# EAGLE design eTapper1main36 (EAGLE 8.4.0)
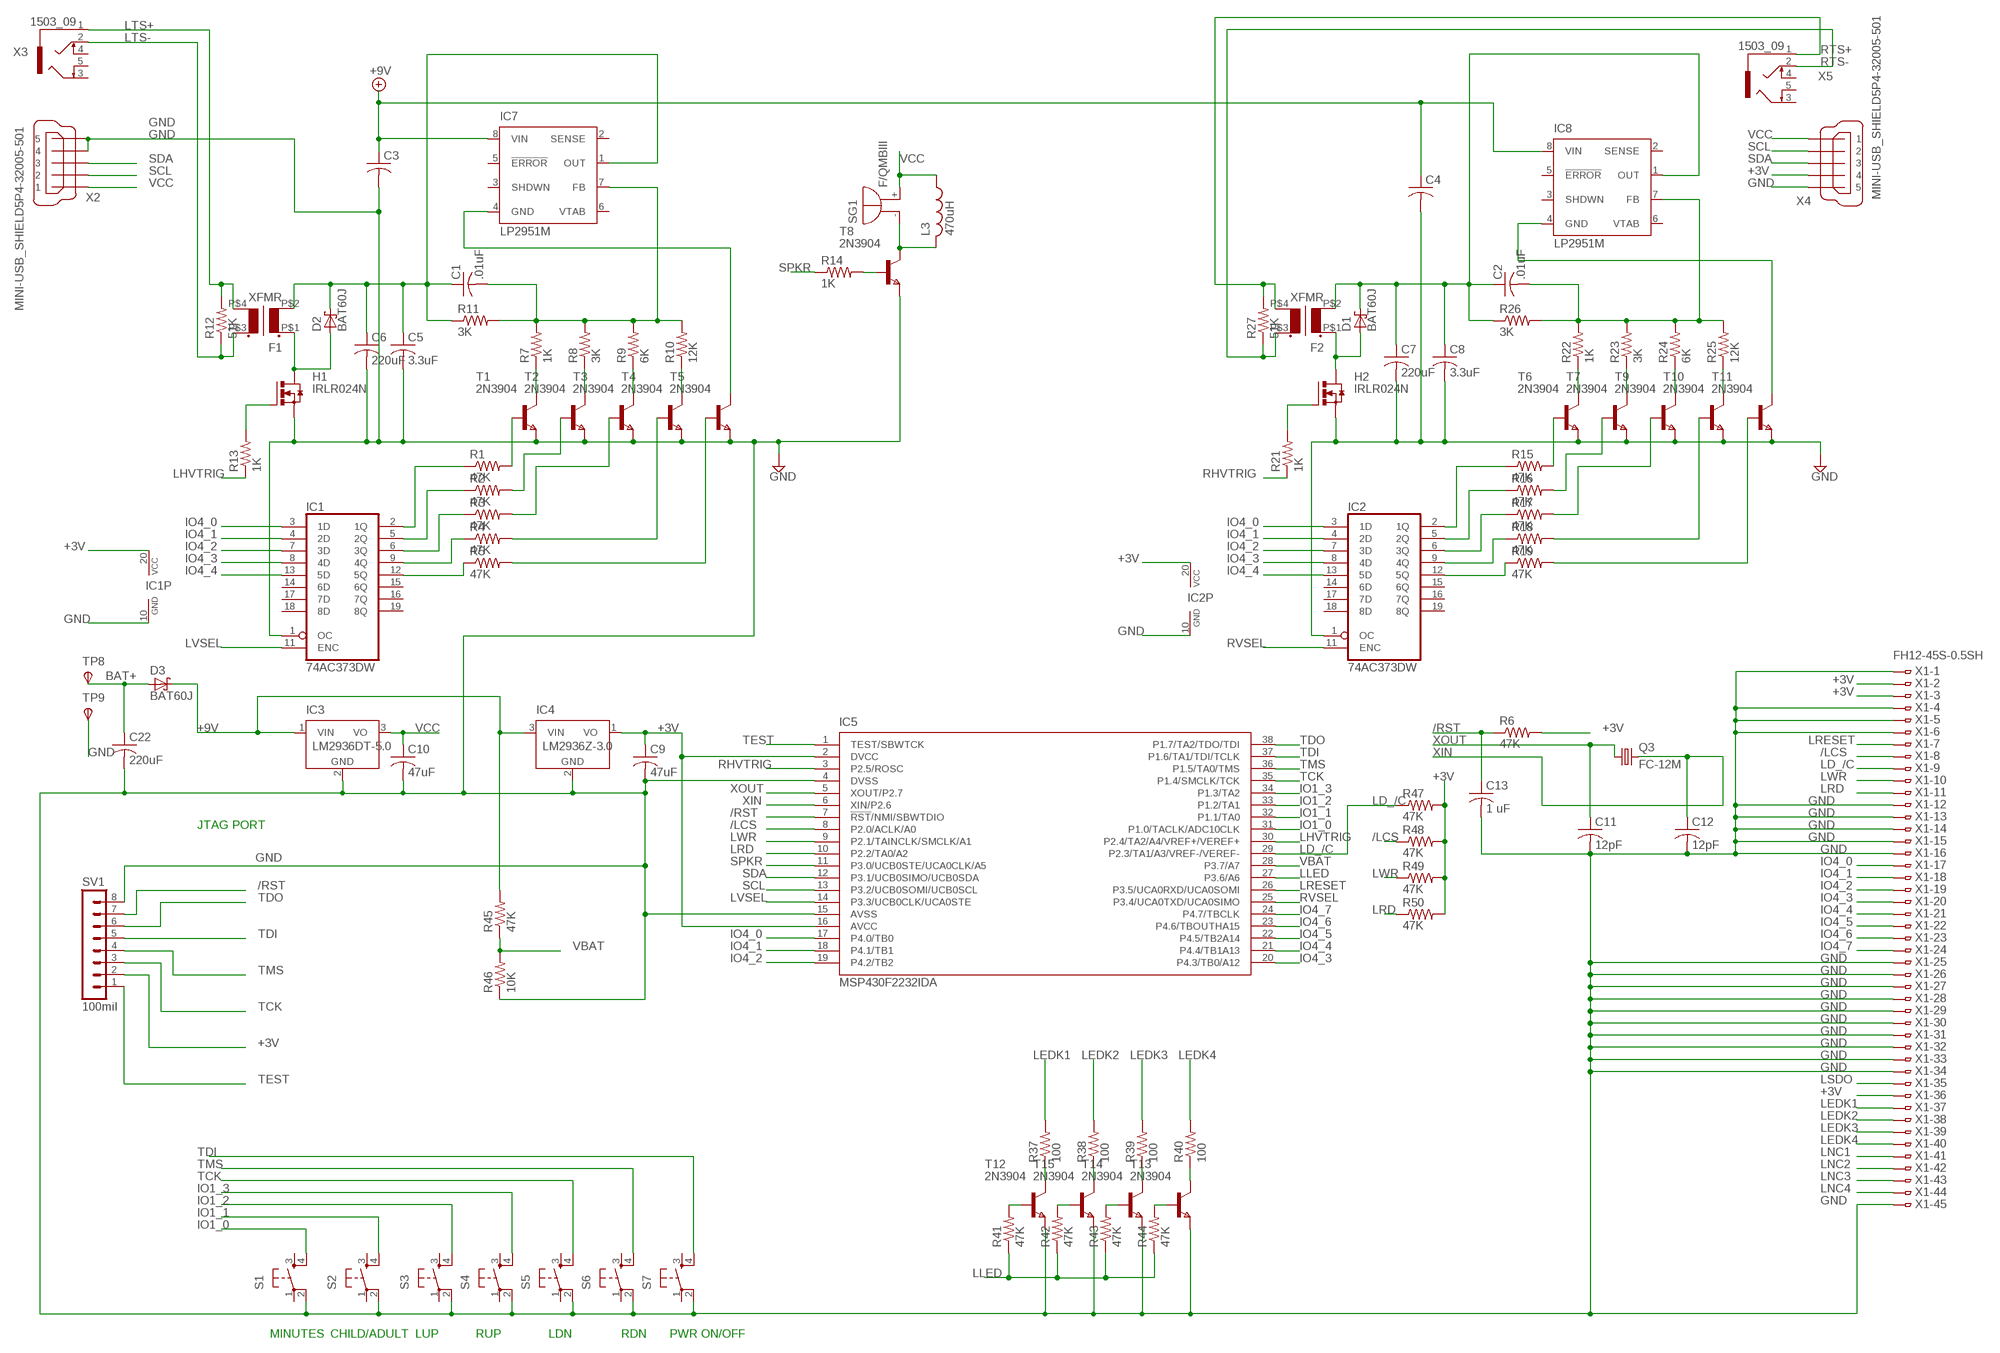
[diagram p0: schematic, sheet 1]

## Parts
C1  .01uF  C-USC0805  [C0805]
C2  .01uF  C-USC0805  [C0805]
C3  C-USC0805  [C0805]
C4  C-USC0805  [C0805]
C5  3.3uF  C-USC0805  [C0805]
C6  220uF  C-USC0805  [C0805]
C7  220uF  C-USC0805  [C0805]
C8  3.3uF  C-USC0805  [C0805]
C9  47uF  C-USC0805  [C0805]
C10  47uF  C-USC0805  [C0805]
C11  12pF  C-USC0805  [C0805]
C12  12pF  C-USC0805  [C0805]
C13  1 uF  C-USC0805  [C0805]
C22  220uF  C-USC0805  [C0805]
D1  BAT60J  [SOD323_ST]
D2  BAT60J  [SOD323_ST]
D3  BAT60J  [SOD323_ST]
F1  XFMR  [XFMR]
F2  XFMR  [XFMR]
H1  IRLR024N  [D-PAK_TO252AA]
H2  IRLR024N  [D-PAK_TO252AA]
IC1  74AC373DW  [SO20W]
IC2  74AC373DW  [SO20W]
IC3  LM2936DT-5.0  [TO252]
IC4  LM2936Z-3.0  [TO92]
IC5  MSP430F2232IDA  [TSSOP38_R-PDSO-G38-DA]
IC7  LP2951M  [SO08]
IC8  LP2951M  [SO08]
L3  470uH  L-USL2825P  [L2825P]
Q3  FC-12M  [FC-12M]
R1  47K  R-US_R0402  [R0402]
R2  47K  R-US_R0402  [R0402]
R3  47K  R-US_R0402  [R0402]
R4  47K  R-US_R0402  [R0402]
R5  47K  R-US_R0402  [R0402]
R6  47K  R-US_R0402  [R0402]
R7  1K  R-US_R0402  [R0402]
R8  3K  R-US_R0402  [R0402]
R9  6K  R-US_R0402  [R0402]
R10  12K  R-US_R0402  [R0402]
R11  3K  R-US_R0402  [R0402]
R12  51K  R-US_R0402  [R0402]
R13  1K  R-US_R0402  [R0402]
R14  1K  R-US_R0402  [R0402]
R15  47K  R-US_R0402  [R0402]
R16  47K  R-US_R0402  [R0402]
R17  47K  R-US_R0402  [R0402]
R18  47K  R-US_R0402  [R0402]
R19  47K  R-US_R0402  [R0402]
R21  1K  R-US_R0402  [R0402]
R22  1K  R-US_R0402  [R0402]
R23  3K  R-US_R0402  [R0402]
R24  6K  R-US_R0402  [R0402]
R25  12K  R-US_R0402  [R0402]
R26  3K  R-US_R0402  [R0402]
R27  51K  R-US_R0402  [R0402]
R37  100  R-US_R0402  [R0402]
R38  100  R-US_R0402  [R0402]
R39  100  R-US_R0402  [R0402]
R40  100  R-US_R0402  [R0402]
R41  47K  R-US_R0402  [R0402]
R42  47K  R-US_R0402  [R0402]
R43  47K  R-US_R0402  [R0402]
R44  47K  R-US_R0402  [R0402]
R45  47K  R-US_R0402  [R0402]
R46  10K  R-US_R0402  [R0402]
R47  47K  R-US_R0402  [R0402]
R48  47K  R-US_R0402  [R0402]
R49  47K  R-US_R0402  [R0402]
R50  47K  R-US_R0402  [R0402]
S1  10-XX  [B3F-10XX]
S2  10-XX  [B3F-10XX]
S3  10-XX  [B3F-10XX]
S4  10-XX  [B3F-10XX]
S5  10-XX  [B3F-10XX]
S6  10-XX  [B3F-10XX]
S7  10-XX  [B3F-10XX]
SG1  F/QMBIII  [F/QMBIII]
SV1  100mil  MA08-1  [MA08-1]
T1  2N3904  NPNSOT23  [SOT-23]
T2  2N3904  NPNSOT23  [SOT-23]
T3  2N3904  NPNSOT23  [SOT-23]
T4  2N3904  NPNSOT23  [SOT-23]
T5  2N3904  NPNSOT23  [SOT-23]
T6  2N3904  NPNSOT23  [SOT-23]
T7  2N3904  NPNSOT23  [SOT-23]
T8  2N3904  NPNSOT23  [SOT-23]
T9  2N3904  NPNSOT23  [SOT-23]
T10  2N3904  NPNSOT23  [SOT-23]
T11  2N3904  NPNSOT23  [SOT-23]
T12  2N3904  NPNSOT23  [SOT-23]
T13  2N3904  NPNSOT23  [SOT-23]
T14  2N3904  NPNSOT23  [SOT-23]
T15  2N3904  NPNSOT23  [SOT-23]
TP8  TPSTP06R  [TP06R]
TP9  TPSTP06R  [TP06R]
X1  FH12-45S-0.5SH  [FH12-45S-0.5SH]
X2  MINI-USB_SHIELD5P4-32005-501  [32005-501]
X3  1503_09  [1503_09]
X4  MINI-USB_SHIELD5P4-32005-501  [32005-501]
X5  1503_09  [1503_09]

## Nets
+3V [+3V]: C9.1 IC1.20(VCC) IC2.20(VCC) IC4.1(VO) IC5.2(DVCC) IC5.16(AVCC) R6.2 R47.2 R48.2 R49.2 R50.2 SV1.2 X1.2 X1.3 X1.36 X4.4
+9V [+9V]: C3.1 C4.1 D3.C IC3.1(VIN) IC4.3(VIN) IC7.8(VIN) IC8.8(VIN) R45.2
/LCS: IC5.8(P2.0/ACLK/A0) R48.1 X1.8
/RST: C13.1 IC5.7(!RST!/NMI/SBWTDIO) R6.1 SV1.7
BAT+ [BAT+]: C22.1 D3.A TP8.TP(PP)
GND [GND]: C3.2 C4.2 C5.2 C6.2 C7.2 C8.2 C9.2 C10.2 C11.2 C12.2 C13.2 C22.2 H1.3(S) H2.3(S) IC1.1(OC) IC1.10(GND) IC2.1(OC) IC2.10(GND) IC3.2(GND) IC4.2(GND) IC5.4(DVSS) IC5.15(AVSS) R46.1 S1.2(P1) S2.2(P1) S3.2(P1) S4.2(P1) S5.2(P1) S6.2(P1) S7.2(P1) SV1.8 T1.2(E) T2.2(E) T3.2(E) T4.2(E) T5.2(E) T6.2(E) T7.2(E) T8.2(E) T9.2(E) T10.2(E) T11.2(E) T12.2(E) T13.2(E) T14.2(E) T15.2(E) TP9.TP(PP) X1.1 X1.4 X1.5 X1.6 X1.12 X1.13 X1.14 X1.15 X1.16 X1.25 X1.26 X1.27 X1.28 X1.29 X1.30 X1.31 X1.32 X1.33 X1.34 X1.45 X2.4 X2.5 X4.5
IO1_0: IC5.31(P1.0/TACLK/ADC10CLK) S1.4(S1)
IO1_1: IC5.32(P1.1/TA0) S2.4(S1)
IO1_2: IC5.33(P1.2/TA1) S3.4(S1)
IO1_3: IC5.34(P1.3/TA2) S4.4(S1)
IO4_0: IC1.3(1D) IC2.3(1D) IC5.17(P4.0/TB0) X1.17
IO4_1: IC1.4(2D) IC2.4(2D) IC5.18(P4.1/TB1) X1.18
IO4_2: IC1.7(3D) IC2.7(3D) IC5.19(P4.2/TB2) X1.19
IO4_3: IC1.8(4D) IC2.8(4D) IC5.20(P4.3/TB0/A12) X1.20
IO4_4: IC1.13(5D) IC2.13(5D) IC5.21(P4.4/TB1A13) X1.21
IO4_5: IC5.22(P4.5/TB2A14) X1.22
IO4_6: IC5.23(P4.6/TBOUTHA15) X1.23
IO4_7: IC5.24(P4.7/TBCLK) X1.24
LD_/C: IC5.29(P2.3/TA1/A3/VREF-/VEREF-) R47.1 X1.9
LEDK1: R37.2 X1.37
LEDK2: R38.2 X1.38
LEDK3: R39.2 X1.39
LEDK4: R40.2 X1.40
LHVTRIG: IC5.30(P2.4/TA2/A4/VREF+/VEREF+) R13.1
LLED: IC5.27(P3.6/A6) R41.1 R42.1 R43.1 R44.1
LNC1: X1.41
LNC2: X1.42
LNC3: X1.43
LNC4: X1.44
LRD: IC5.10(P2.2/TA0/A2) R50.1 X1.11
LRESET: IC5.26(P3.5/UCA0RXD/UCA0SOMI) X1.7
LSDO: X1.35
LTS+: F1.P$4(S2) R12.2 X3.1
LTS-: F1.P$3(S1) R12.1 X3.2
LVSEL: IC1.11(ENC) IC5.14(P3.3/UCB0CLK/UCA0STE)
LWR: IC5.9(P2.1/TAINCLK/SMCLK/A1) R49.1 X1.10
N$1: IC1.2(1Q) R1.1
N$2: IC1.5(2Q) R2.1
N$3: IC1.6(3Q) R3.1
N$4: IC1.9(4Q) R4.1
N$5: IC1.12(5Q) R5.1
N$6: L3.2 SG1.-(+) T8.1(C)
N$7: R4.2 T4.3(B)
N$8: R5.2 T5.3(B)
N$9: D2.A F1.P$1(P1) H1.4(D)
N$10: R7.1 T1.1(C)
N$11: R8.1 T2.1(C)
N$12: R9.1 T3.1(C)
N$13: R1.2 T1.3(B)
N$14: R2.2 T2.3(B)
N$15: R3.2 T3.3(B)
N$16: R10.1 T4.1(C)
N$17: C1.2 IC7.7(FB) R7.2 R8.2 R9.2 R10.2 R11.2
N$18: C1.1 C5.1 C6.1 D2.C F1.P$2(P2) IC7.1(OUT) R11.1
N$19: D1.A F2.P$1(P1) H2.4(D)
N$20: IC2.2(1Q) R15.1
N$21: H1.1(G) R13.2
N$22: R14.2 T8.3(B)
N$24: IC2.5(2Q) R16.1
N$25: IC2.6(3Q) R17.1
N$26: IC2.9(4Q) R18.1
N$27: IC2.12(5Q) R19.1
N$28: R44.2 T13.3(B)
N$29: R15.2 T6.3(B)
N$30: R16.2 T7.3(B)
N$31: R17.2 T9.3(B)
N$32: R18.2 T10.3(B)
N$33: R19.2 T11.3(B)
N$35: R22.1 T6.1(C)
N$36: R23.1 T7.1(C)
N$37: R24.1 T9.1(C)
N$38: R25.1 T10.1(C)
N$39: C2.2 IC8.7(FB) R22.2 R23.2 R24.2 R25.2 R26.2
N$40: C2.1 C7.1 C8.1 D1.C F2.P$2(P2) IC8.1(OUT) R26.1
N$41: R37.1 T12.1(C)
N$42: H2.1(G) R21.2
N$43: R38.1 T15.1(C)
N$44: R39.1 T14.1(C)
N$45: IC7.4(GND) T5.1(C)
N$46: R40.1 T13.1(C)
N$47: IC8.4(GND) T11.1(C)
N$48: R43.2 T14.3(B)
N$49: R41.2 T12.3(B)
N$50: R42.2 T15.3(B)
RHVTRIG: IC5.3(P2.5/ROSC) R21.1
RTS+: F2.P$4(S2) R27.2 X5.1
RTS-: F2.P$3(S1) R27.1 X5.2
RVSEL: IC2.11(ENC) IC5.25(P3.4/UCA0TXD/UCA0SIMO)
SCL: IC5.13(P3.2/UCB0SOMI/UCB0SCL) X2.2 X4.2
SDA: IC5.12(P3.1/UCB0SIMO/UCB0SDA) X2.3 X4.3
SPKR: IC5.11(P3.0/UCB0STE/UCA0CLK/A5) R14.1
TCK: IC5.35(P1.4/SMCLK/TCK) S5.4(S1) SV1.3
TDI: IC5.37(P1.6/TA1/TDI/TCLK) S7.4(S1) SV1.5
TDO: IC5.38(P1.7/TA2/TDO/TDI) SV1.6
TEST: IC5.1(TEST/SBWTCK) SV1.1
TMS: IC5.36(P1.5/TA0/TMS) S6.4(S1) SV1.4
VBAT: IC5.28(P3.7/A7) R45.1 R46.2
VCC [VCC]: C10.1 IC3.3(VO) L3.1 SG1.+(-) X2.1 X4.1
XIN: C12.1 IC5.6(XIN/P2.6) Q3.2
XOUT: C11.1 IC5.5(XOUT/P2.7) Q3.1
Unconnected: IC1.14(6D) IC1.15(6Q) IC1.16(7Q) IC1.17(7D) IC1.18(8D) IC1.19(8Q) IC2.14(6D) IC2.15(6Q) IC2.16(7Q) IC2.17(7D) IC2.18(8D) IC2.19(8Q) IC7.2(SENSE) IC7.3(SHDWN) IC7.5(!ERROR) IC7.6(VTAB) IC8.2(SENSE) IC8.3(SHDWN) IC8.5(!ERROR) IC8.6(VTAB) S1.1(P) S1.3(S) S2.1(P) S2.3(S) S3.1(P) S3.3(S) S4.1(P) S4.3(S) S5.1(P) S5.3(S) S6.1(P) S6.3(S) S7.1(P) S7.3(S) X2.M1(S1) X2.M2(S2) X2.M3(S3) X2.M4(S4) X3.3 X3.4 X3.5 X4.M1(S1) X4.M2(S2) X4.M3(S3) X4.M4(S4) X5.3 X5.4 X5.5

## Notes on the sheet
- JTAG PORT
- MINUTES | CHILD/ADULT | LUP | RUP | LDN | RDN | PWR ON/OFF

## Library data of the parts
C1-C13 C22 = rcl:C-US: CAPACITOR, American symbol
D1-D3 = diode:BAT60J: Schottky barrier diode Source: www.st.com, BAT60J.pdf
F1 F2 = XFMR1:XFMR: Transformer 1"X1" 0.4"X0.4" hole separation for e_tapper
H1 H2 = IRLR024N:IRLR024N: IRLR024N HEXFET Power Mosfet N channel Infeneon Technology TO-251AA IPAK
IC1 IC2 = 74xx-eu:74*373: Octal D type transparent LATCH, edge triggered
IC3 = national-semiconductor:LM2936?*: Ultra-Low Quiescent Current LDO Voltage Regulator Source: Data sheet <http://www.national.com/ds/LM/LM2936.pdf>; MF: NATIONAL SEMICONDUCTOR; MPN: LM2936DT-5.0/NOPB; OC_FARNELL: 1286864; OC_NEWARK: 41K4501
IC4 = national-semiconductor:LM2936?*: Ultra-Low Quiescent Current LDO Voltage Regulator Source: Data sheet <http://www.national.com/ds/LM/LM2936.pdf>; MF: NATIONAL SEMICONDUCTOR; MPN: LM2936Z-3.0/NOPB; OC_FARNELL: 1312709; OC_NEWARK: 41K4531
IC5 = texas:MSP430F22*2IDA: MIXED SIGNAL MICROCONTROLLER Source: http://focus.ti.com/lit/ds/symlink/msp430f2274.pdf; MPN: MSP430F2232IDA; OC_FARNELL: 1610178; OC_NEWARK: 28M6312
IC7 IC8 = national-semiconductor:LP2951: Adjustable Micropower Voltage Regulator Source: http://www.national.com/ds/LP/LP2950.pdf; MF: FAIRCHILD SEMICONDUCTOR; MPN: LP2951CM; OC_FARNELL: 9488561; OC_NEWARK: 78K6014
L3 = rcl:L-US: INDUCTOR, American symbol
Q3 = crystal:FC-12M: kHz RANGE CRYSTAL UNIT LOW PROFILE SMD Source: Epson Toyocom FC-12M.pdf
R1-R19 R21-R27 R37-R50 = resistor:R-US_: RESISTOR, American symbol
S1-S7 = switch-omron:10-XX: OMRON SWITCH; MPN: B3F-1000; OC_FARNELL: 176432; OC_NEWARK: 36M3542
SG1 = buzzer:F/QMBIII: BUZZER Source: Buerklin; OC_FARNELL: unknown; OC_NEWARK: unknown
SV1 = con-lstb:MA08-1: PIN HEADER; OC_FARNELL: unknown; OC_NEWARK: unknown
T1-T15 = zetex:NPNSOT23: NPN TRANSISTOR; MPN: DSS20201L-7; OC_FARNELL: 1710688; OC_NEWARK: 25R4555
TP8 TP9 = testpad:TPS: TEST PIN
X1 = con-hirose:FH12-45S-0.5S: 0.5mm Pitch Connectors For FPC/FFC Source: Data sheet <http://www.hirose.co.jp/cataloge_hp/e58605370.pdf>; OC_FARNELL: unknown; OC_NEWARK: unknown
X2 X4 = con-cypressindustries:MINI-USB_SHIELD5P4-: MINI USB-B R/A W/O POST 5 pol. Source: www.cypressindustries.com; OC_FARNELL: unknown; OC_NEWARK: unknown
X3 X5 = con-lumberg:1503_09: Jack connectors according to JISC 6560, 3.5 mm Klinkeneinbaukupplung nach JISC 6560, 3,5 mm, 3-polig/ stereo, abgewinkelte Ausführung, mit 2 Öffnern und Lötaugen, für Leiterplatten Rückseitenmontage Source: http://www.lumberg.com/Produkte/PDFs/1503_09.pdf; OC_FARNELL: 1243244; OC_NEWARK: unknown

## Module LP2951
Ports: 

### Library data of the parts

## Net classes
1 GND: width 0.305 mm, clearance 0.152 mm
2 BAT+: width 0.305 mm, clearance 0.152 mm
3 +9V: width 0.305 mm, clearance 0.152 mm
4 +3V: width 0.305 mm, clearance 0.152 mm
5 VCC: width 0.305 mm, clearance 0.152 mm

## Board
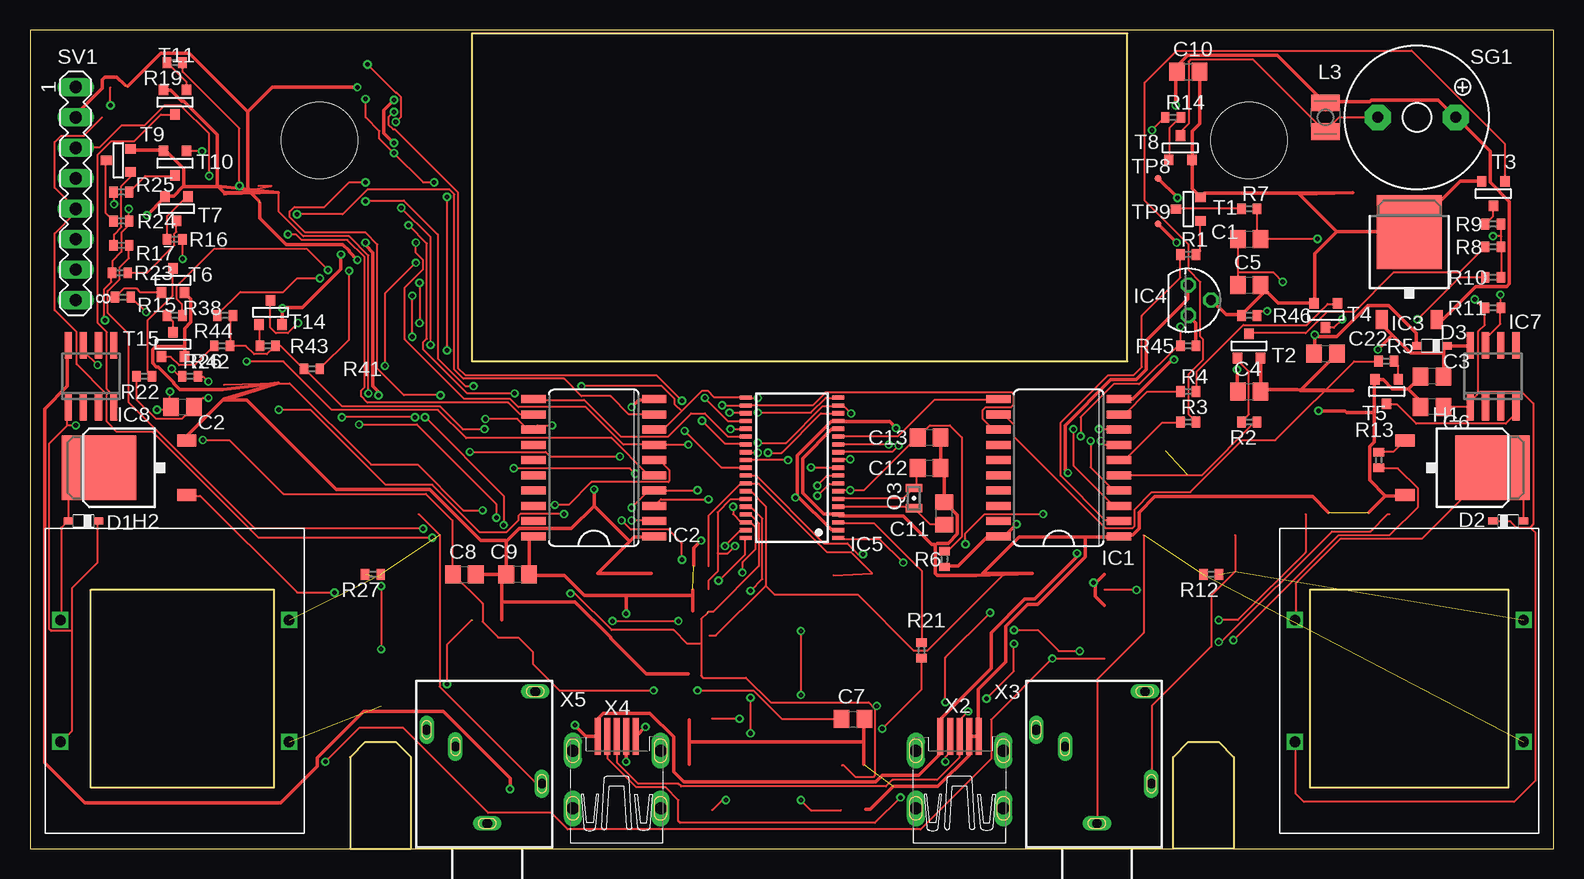
[diagram p1: board, top side]
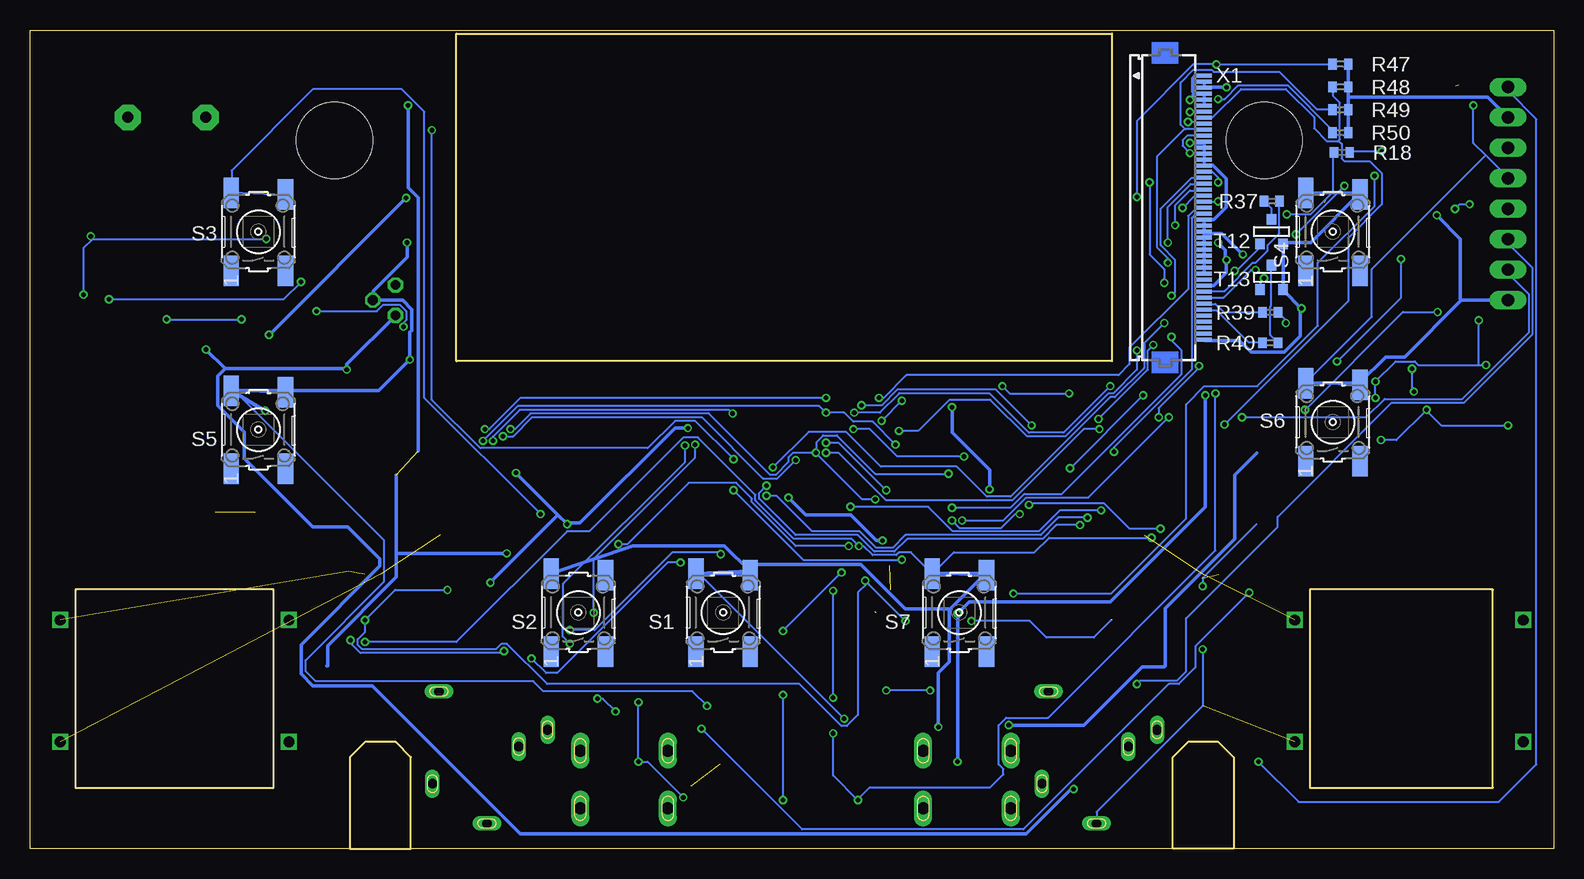
[diagram p2: board, bottom side, seen from below]

Size 126.98 x 68.25 mm. Coordinates in mm from the lower left corner, seen from the top.
Outline: 26.67,0 0,0 0,68.25 126.98,68.25 126.98,0 100.33,0
Outline: 31.75,0 95.25,0
Outline: 26.67,0 26.67,7.62 27.94,8.89 30.48,8.89 31.75,7.62 31.75,0
Outline: 26.67,0 31.75,0
Outline: 95.25,0 95.25,7.62 96.52,8.89 99.06,8.89 100.33,7.62 100.33,0
Outline: 100.33,0 95.25,0
Outline: 106.68,21.59 123.19,21.59 123.19,5.08 106.68,5.08 106.68,21.59
Outline: 5.08,21.59 20.32,21.59 20.32,5.08 5.08,5.08 5.08,21.59
Outline: 36.83,67.94 36.83,40.64 91.44,40.64 91.44,67.94 36.83,67.94
Copper layers (1*16): Top 0.035mm / dielectric 1.5mm / Bottom 0.035mm
Design rules "default *": minimum track width 6mil, minimum drill 15mil, track to track 6mil, track to pad 6mil, pad to pad 6mil, via to via 6mil, smd to smd 6mil, copper to edge 40mil, drill to drill 6mil, minimum pad ring 6mil, minimum via ring 6mil, stop-mask expansion 4mil, vias tented up to drill 0mil, thermal gap 10mil
Holes 6.35 mm at 24.13,59.05 101.6,59.05

### Footprints (pad centres in the part's own frame; a part is rotated, then mirrored left to right if it is on the bottom)
C0805 = smd 1.3 x 1.5: 1 -0.95,0; 2 0.95,0
SOD323_ST = smd 0.8 x 0.6: A 1.25,0; C -1.25,0
XFMR = drill 0.889 square: P$1 -10.16,5.08; P$2 -10.16,-5.08; P$3 8.89,5.08; P$4 8.89,-5.08
D-PAK_TO252AA = smd 1 x 1.6: 1 -2.28,-4.8; 3 2.28,-4.8 | smd 5.4 x 6.2: 4 0,2.5
SO20W = smd 0.66 x 2.032: 1 -5.715,-5.029; 2 -4.445,-5.029; 3 -3.175,-5.029; 4 -1.905,-5.029; 5 -0.635,-5.029; 6 0.635,-5.029; 7 1.905,-5.029; 8 3.175,-5.029; 9 4.445,-5.029; 10 5.715,-5.029; 11 5.715,5.029; 12 4.445,5.029; 13 3.175,5.029; 14 1.905,5.029; 15 0.635,5.029; 16 -0.635,5.029; 17 -1.905,5.029; 18 -3.175,5.029; 19 -4.445,5.029; 20 -5.715,5.029
TO252 = smd 1 x 1.6: 1 -2.28,-4.8; 3 2.28,-4.8 | smd 5.4 x 6.2: 2 0,2.5
TO92 = drill 0.813 pad 1.27 octagon: 1 -1.27,0; 2 0,1.905; 3 1.27,0
TSSOP38_R-PDSO-G38-DA = smd 0.35 x 1: 1 -5.85,-3.85; 2 -5.2,-3.85; 3 -4.55,-3.85; 4 -3.9,-3.85; 5 -3.25,-3.85; 6 -2.6,-3.85; 7 -1.95,-3.85; 8 -1.3,-3.85; 9 -0.65,-3.85; 10 0,-3.85; 11 0.65,-3.85; 12 1.3,-3.85; 13 1.95,-3.85; 14 2.6,-3.85; 15 3.25,-3.85; 16 3.9,-3.85; 17 4.55,-3.85; 18 5.2,-3.85; 19 5.85,-3.85; 20 5.85,3.85; 21 5.2,3.85; 22 4.55,3.85; 23 3.9,3.85; 24 3.25,3.85; 25 2.6,3.85; 26 1.95,3.85; 27 1.3,3.85; 28 0.65,3.85; 29 0,3.85; 30 -0.65,3.85; 31 -1.3,3.85; 32 -1.95,3.85; 33 -2.6,3.85; 34 -3.25,3.85; 35 -3.9,3.85; 36 -4.55,3.85; 37 -5.2,3.85; 38 -5.85,3.85
SO08 = smd 0.6 x 2.2: 1 -1.905,-2.6; 2 -0.635,-2.6; 3 0.635,-2.6; 4 1.905,-2.6; 5 1.905,2.6; 6 0.635,2.6; 7 -0.635,2.6; 8 -1.905,2.6
L2825P = smd 1.4 x 2.4: 1 -1.2,0; 2 1.2,0
FC-12M = smd 0.7 x 1.4: 1 -0.85,0; 2 0.85,0
R0402 = smd 0.7 x 0.9: 1 -0.65,0; 2 0.65,0
B3F-10XX = smd 2.54 x 1.27: 1 -3.251,2.261; 2 3.251,2.261; 3 -3.251,-2.261; 4 3.099,-2.261
F/QMBIII = drill 0.914 pad 2.159 octagon: + 3.251,0; - -3.251,0
MA08-1 = drill 1.016 long: 1 -8.89,0; 2 -6.35,0; 3 -3.81,0; 4 -1.27,0; 5 1.27,0; 6 3.81,0; 7 6.35,0; 8 8.89,0
SOT-23 = smd 0.787 x 0.889: 1 0.025,-1.016; 2 -0.94,1.016; 3 0.991,1.016
TP06R = smd 0.6 x 0.6: TP 0,0
FH12-45S-0.5SH = smd 0.3 x 1.3: 1 -13,3.25; 2 -12.5,3.25; 3 -12,3.25; 4 -11.5,3.25; 5 -11,3.25; 6 -10.5,3.25; 7 -10,3.25; 8 -9.5,3.25; 9 -9,3.25; 10 -8.5,3.25; 11 -8,3.25; 12 -7.5,3.25; 13 -7,3.25; 14 -6.5,3.25; 15 -6,3.25; 16 -5.5,3.25; 17 -5,3.25; 18 -4.5,3.25; 19 -4,3.25; 20 -3.5,3.25; 21 -3,3.25; 22 -2.5,3.25; 23 -2,3.25; 24 -1.5,3.25; 25 -1,3.25; 26 -0.5,3.25; 27 0,3.25; 28 0.5,3.25; 29 1,3.25; 30 1.5,3.25; 31 2,3.25; 32 2.5,3.25; 33 3,3.25; 34 3.5,3.25; 35 4,3.25; 36 4.5,3.25; 37 5,3.25; 38 5.5,3.25; 39 6,3.25; 40 6.5,3.25; 41 7,3.25; 42 7.5,3.25; 43 8,3.25; 44 8.5,3.25; 45 9,3.25
32005-501 = smd 3.1 x 0.5: 1 3,1.6; 2 3,0.8; 3 3,0; 4 3,-0.8; 5 3,-1.6 | drill 1 pad 1.422 long: M1 -3,3.65; M2 -3,-3.65; M3 1.8,3.65; M4 1.8,-3.65
1503_09 = drill 0.8 pad 1.2 long: 1 0,-2.1; 2 -4.55,-5.4; 3 5.05,-9.9; 4 -4,-13.1; 5 2.65,-8.5

### Placement (x,y rotation side)
C1  101.6,50.8 0 top
C2  12.7,36.83 0 top
C3  116.84,39.37 180 top
C4  101.6,38.1 0 top
C5  101.6,46.99 0 top
C6  116.84,36.83 180 top
C7  68.58,10.79 0 top
C8  36.2,22.86 0 top
C9  40.64,22.86 180 top
C10  96.52,64.77 0 top
C11  76.2,27.94 90 top
C12  74.93,31.75 0 top
C13  74.93,34.29 0 top
C22  107.95,41.27 0 top
D1  4.45,27.3 180 top
D2  123.19,27.3 0 top
D3  116.84,41.91 180 top
F1  115.57,13.97 0 top
F2  12.7,13.97 0 top
H1  119.38,31.75 270 top
H2  8.26,31.75 90 top
IC1  85.72,31.75 90 top
IC2  46.99,31.75 90 top
IC3  114.94,48.9 0 top
IC4  96.52,45.72 270 top
IC5  63.5,31.75 90 top
IC7  121.92,39.37 0 top
IC8  5.08,39.37 0 top
L3  107.95,60.96 270 top
Q3  73.66,29.21 90 top
R1  96.52,49.53 0 top
R2  101.6,35.56 180 top
R3  96.52,35.56 0 top
R4  96.52,38.1 0 top
R5  113.03,40.64 0 top
R6  76.2,24.13 270 top
R7  101.6,53.34 0 top
R8  121.92,50.16 0 top
R9  121.92,52.07 0 top
R10  121.92,47.62 0 top
R11  121.92,45.09 0 top
R12  98.42,22.86 180 top
R13  112.39,32.38 90 top
R14  95.25,60.96 0 top
R15  7.75,45.97 180 top
R16  12.06,50.8 180 top
R17  7.62,50.29 180 top
R18  17.65,58.04 0 bottom
R19  12.06,65.53 180 top
R21  74.3,16.51 270 top
R22  9.53,39.37 180 top
R23  7.49,48.01 180 top
R24  7.62,52.32 0 top
R25  7.62,54.74 180 top
R26  13.34,39.37 0 top
R27  28.57,22.86 180 top
R37  23.5,53.98 0 bottom
R38  12.06,44.45 0 top
R39  23.62,44.7 180 bottom
R40  23.62,42.16 180 bottom
R41  23.5,40.01 0 top
R42  16,41.91 180 top
R43  19.81,41.91 180 top
R44  16.26,44.45 180 top
R45  96.52,41.91 0 top
R46  101.6,44.45 0 top
R47  17.78,65.41 0 bottom
R48  17.78,63.5 0 bottom
R49  17.78,61.59 0 bottom
R50  17.78,59.69 0 bottom
S1  69.22,19.68 90 bottom
S2  81.28,19.68 90 bottom
S3  107.95,51.44 90 bottom
S4  18.41,51.44 90 bottom
S5  107.95,34.92 90 bottom
S6  18.41,35.56 90 bottom
S7  49.53,19.68 90 bottom
SG1  115.57,60.96 0 top
SV1  3.81,54.61 270 top
T1  96.52,53.34 270 top
T2  101.6,41.91 180 top
T3  121.92,54.61 0 top
T4  107.95,44.45 0 top
T5  113.03,38.1 0 top
T6  11.94,47.37 180 top
T7  12.19,53.34 0 top
T8  95.89,58.42 180 top
T9  7.37,57.4 270 top
T10  12.06,57.15 0 top
T11  12.06,62.23 0 top
T12  23.5,51.44 180 bottom
T13  23.5,47.62 180 bottom
T14  20.07,44.7 180 top
T15  11.94,42.04 180 top
TP8  93.98,55.88 0 top
TP9  93.98,52.07 0 top
X1  32.38,51.44 270 bottom
X2  77.47,6.35 90 top
X3  88.9,0 180 top
X4  48.9,6.35 90 top
X5  38.1,0 180 top

### Tracks (layer width: path | path; a pad name or v marks a point on that pad's centre or on a via)
+3V  (via drill 0.38)  (3 unrouted)
  Top 0.305: 19.05,54.03 18.14,54.94 18.14,61.42 | 18.14,61.42 13.26,66.29 10.9,66.29 8.15,63.55 | v27.28,49.07 26.59,49.76 26.59,49.84 26.06,50.37 21.34,50.37 19.13,52.58 19.13,53.87 | v27.28,63.48 20.19,63.48 18.14,61.42 | SV1.2 3.81,61.19 6.02,63.4 6.02,64.08 6.25,64.31 7.24,64.31 7.92,63.63 | 55.24,19.81 55.24,21.11 | 55.24,21.11 55.24,21.57 | IC2.20 41.6,25.68 41.6,22.86 C9.1 41.68,22.78 44.5,22.78 46.18,21.11 49.68,21.11 | 49.68,21.11 55.24,21.11 | v49.68,7.24 49.68,9.3 X4.4 | 49.68,21.11 v49.68,19.58 | 63.93,29.41 66.75,26.59 67.28,26.59 IC5.2 | 63.93,29.41 63.93,32.77 66.75,35.59 67.28,35.59 IC5.16 67.44,35.59 71.63,35.59 v72.16,35.05 | 89.53,20.27 88.77,21.03 88.77,22.1 | 89.53,22.86 88.77,22.1 | R6.2 76.2,23.55 77.34,23.55 79.78,25.98 80.7,25.98 IC1.20 80.77,26.14 81.31,26.14 v82.22,27.05 | v86.49,31.32 86.26,31.55 86.26,35.28 90.07,39.09 92.2,39.09 93.04,39.93 93.04,42.37 96.47,45.8 96.47,46.94 IC4.1 | v88.62,22.17 88.7,22.17 88.77,22.1 | 55.32,23.62 55.32,25.07 v55.93,25.68 | v63.78,29.26 63.93,29.41 | v27.96,50.52 27.96,50.29 28.57,49.68 28.57,38.56 29.03,38.1 v29.03,37.8
  Bottom 0.305: R50.2 17.14,59.74 17.14,61.57 R49.2 17.14,61.72 17.14,62.64 | 17.14,62.64 17.14,63.48 R48.2 17.14,63.63 17.14,65.38 R47.2 | 17.14,62.64 5.49,62.64 SV1.2 | X1.2 29.11,63.93 29.11,63.48 X1.3 28.96,63.48 v27.28,63.48 | X1.36 29.11,46.94 28.35,46.94 27.28,48.01 v27.28,49.07 27.36,49.15 27.36,49.91 v27.96,50.52 | v49.68,7.24 v49.68,19.58 48.69,20.57 36.96,20.57 29.03,28.5 v29.03,37.8 | 82.98,27.81 v82.22,27.05 82.14,27.13 81.15,27.13 73.23,35.05 v72.16,35.05 | 82.98,27.81 v86.49,31.32 | 82.98,27.81 v88.62,22.17 | v55.93,25.68 56.46,25.68 58.6,27.81 62.33,27.81 v63.78,29.26
+9V  (via drill 0.38)
  Top 0.305: IC7.8 120.02,41.91 D3.C 117.96,41.83 117.81,41.68 117.81,41.3 | 117.81,41.3 117.81,39.4 C3.1 | 113.54,42.82 115.06,41.3 117.81,41.3 | 113.54,42.82 112.7,43.66 112.7,44.04 IC3.1 | IC4.3 97.16,43.81 97.16,41.91 R45.2 | v100.58,39.93 100.58,38.1 C4.1 | v40.01,4.95 40.01,5.87 34.44,11.43 27.81,11.43 23.93,7.54 23.93,6.86 20.88,3.81 4.57,3.81 1.22,7.16 1.22,36.65 3.12,38.56 3.12,41.91 IC8.8 | v112.32,41.6 113.54,42.82
  Bottom 0.305: IC4.3 100.58,40.39 v100.58,39.93 100.66,40.01 110.72,40.01 | v40.01,4.95 40.23,4.95 43.97,1.22 86.11,1.22 98.45,13.56 103.4,13.56 104.39,14.55 104.39,16.99 97.84,23.55 97.84,24.16 100.51,26.82 103.4,26.82 109.12,32.54 109.12,34.75 111.33,36.96 111.33,39.4 110.72,40.01 | 110.72,40.01 v112.32,41.6
/LCS  (via drill 0.38)
  Top 0.152: v65.61,29.41 66.6,30.4 67.28,30.4 IC5.8 | v38.86,27.58 38.86,28.73 32.23,35.36 v27.43,35.36
  Bottom 0.152: 17.95,59.02 17.98,58.98 18.9,58.98 19.96,60.05 19.96,60.96 22.33,63.32 26.06,63.32 28.42,60.96 29.11,60.96 X1.8 | 17.95,59.02 17.83,59.13 17.83,62.18 18.36,62.71 18.36,63.48 R48.1 | v65.61,29.41 64.77,29.41 61.8,26.44 57.84,26.44 56.46,25.07 55.09,25.07 54.03,26.14 42.75,26.14 41.3,27.58 v38.86,27.58 | v27.43,35.36 17.14,45.64 17.14,50.9 14.33,53.72 14.33,56.31 15.32,57.3 17.45,57.3 17.68,57.53 17.68,58.75 17.95,59.02
/RST  (via drill 0.38)
  Top 0.152: R6.1 76.2,24.84 76.5,24.84 77.65,25.98 77.65,34.29 76.66,35.28 74.98,35.28 C13.1 73.91,34.29 69.49,29.87 v68.35,29.87 67.36,29.87 IC5.7 | v32.08,35.97 v25.98,35.97 | v49.3,27.36 50.06,26.59 53.19,26.59 54.33,25.45 v54.33,24.08
  Bottom 0.152: SV1.7 3.81,47.93 2.06,46.18 2.06,43.05 7.62,37.49 14.1,37.49 15.62,35.97 v25.98,35.97 | v32.08,35.97 38.79,29.26 43.97,29.26 45.87,27.36 v49.3,27.36 | v54.33,24.08 62.56,24.08 v68.35,29.87
BAT+  (via drill 0.38)
  Top 0.305: v95.63,54.25 94.03,55.85 TP8.TP | C22.1 107.06,41.3 v107.06,42.82 107.14,42.67 108.89,42.67 111.48,45.26 113.23,45.26 115.52,42.98 115.52,41.91 D3.A
  Bottom 0.305: v107.06,42.82 v95.63,54.25
GND  (via drill 0.38)  (2 unrouted)
  Top 0.305: 12.88,41.83 12.88,43.36 13.41,43.89 13.41,45.8 12.88,46.33 T6.2 | 12.88,41.83 T15.2 | S6.2 16.15,37.49 13.11,34.44 13.11,34.06 H2.3 | 12.88,41.83 10.44,41.83 10.21,41.6 10.21,40.46 10.52,40.16 10.67,40.16 11.96,38.86 11.96,38.79 12.5,38.25 16.08,38.25 S6.2 | v30.33,62.41 29.49,61.57 29.49,59.66 v30.33,58.83 | T14.2 21.03,43.74 v21.03,45.03 21.11,45.11 22.71,45.11 25.91,48.31 v25.91,49.53 | T9.2 8.38,58.29 8.46,58.22 11.12,58.22 T10.2 11.2,58.06 11.43,58.06 12.8,56.69 12.8,55.24 12.72,55.17 | 12.72,55.17 11.96,54.41 11.28,54.41 T7.2 11.2,54.25 v9.75,52.81 | 12.72,55.17 15.7,55.17 16.15,54.71 S4.2 15.62,55.24 15.62,59.51 12.8,62.33 12.65,62.33 11.73,63.25 T11.2 | 69.49,8.91 69.49,10.74 C7.2 | 69.49,8.91 69.49,7.01 | 54.94,10.74 54.94,8.91 | 54.94,8.91 54.94,7.01 | 54.94,8.91 69.49,8.91 | C9.2 C8.2 | 39.32,19.05 39.32,20.57 | 39.32,20.57 39.32,22.78 C9.2 | 49.99,25.6 47.32,22.94 S7.2 | 49.99,25.6 50.37,25.98 51.97,25.98 IC2.1 | v50.14,36.8 50.75,37.41 51.97,37.41 IC2.10 | 47.02,28.57 v47.02,29.95 | 49.99,25.6 47.02,28.57 | v51.28,10.13 50.52,9.37 X4.5 | 39.7,25.6 39.7,23.01 C9.2 | 39.7,25.6 40.77,26.67 45.11,26.67 47.02,28.57 | 54.86,14.55 51.36,14.55 48.39,17.53 48.39,17.6 45.41,20.57 39.32,20.57 | S6.2 16.23,37.41 18.06,37.41 25.53,29.95 33.3,29.95 37.57,25.68 39.62,25.68 39.7,25.6 | T2.2 102.56,40.84 102.56,38.1 C4.2 102.64,38.25 105.61,38.25 S5.2 105.84,38.18 108.89,41.22 C22.2 | v95.56,50.52 94.03,52.05 TP9.TP | v95.33,40.77 95.17,40.77 91.9,37.49 90.75,37.49 IC1.10 | IC4.2 98.45,45.72 99.67,44.5 100.81,44.5 R46.1 100.97,44.5 102.95,46.48 C5.2 102.56,46.94 104.01,45.49 106.98,45.49 T4.2 107.06,45.57 107.06,49.61 108.89,51.44
  Top 0.305: T3.2 119.18,55.63 114.99,51.44 IC3.2 114.83,51.44 108.89,51.44 | C10.2 97.46,60.43 96.85,59.82 96.85,57.53 T8.2 96.85,57.38 96.85,55.02 97.54,54.33 T1.2 97.61,54.41 97.84,54.63 105.69,54.63 S3.2 105.77,54.56 108.89,51.44 | 69.65,3.28 70.03,3.28 71.93,5.18 75.67,5.18 78.26,7.77 78.26,9.22 X2.4 78.33,9.37 79.02,9.37 X2.5 79.02,9.53 79.02,13.26 81.31,15.54 81.31,18.52 83.13,20.34 83.97,20.34 87.94,24.31 87.94,25.98 | 114.83,38.33 113.54,38.33 112.78,39.09 112.09,39.09 T5.2 112.01,39.01 112.01,36.35 | 114.83,38.33 115.82,39.32 C3.2 | 114.83,38.33 115.82,37.34 115.82,36.88 C6.2 | 112.93,29.41 114.53,29.41 H1.3 | 111.56,28.04 112.93,29.41 | 112.01,36.35 112.01,33.91 111.63,33.53 111.63,30.71 112.93,29.41 | IC5.15 67.28,34.98 66.83,34.98 64.39,32.54 64.39,29.64 66.14,27.89 67.28,27.89 IC5.4 67.44,27.74 72.77,27.74 75.13,25.38 75.36,25.38 75.44,25.3 | C13.2 75.89,34.29 75.89,31.77 C12.2 75.97,31.62 76.2,31.39 C11.2 76.28,28.8 77.27,27.81 77.27,26.21 76.5,25.45 75.59,25.45 75.44,25.3 | 87.94,25.98 82.45,25.98 79.4,22.94 S2.2 78.87,22.78 75.59,22.78 75.44,22.94 75.44,25.3 | 87.94,25.98 90.75,25.98 IC1.1 90.83,26.14 91.9,26.14 92.43,26.67 92.43,28.04 93.73,29.34 106.91,29.34 108.2,28.04 | v107.37,36.5 109.58,36.5 109.73,36.35 112.01,36.35
  Bottom 0.305: 7.7,45.72 SV1.8 | 7.7,45.72 12.42,41 14.02,41 16.15,38.86 S6.2 | X1.6 29.11,61.95 29.11,62.41 X1.5 29.11,62.56 29.11,62.87 X1.4 29.26,62.94 29.95,62.94 | 29.95,62.94 30.1,63.09 30.1,64.24 29.87,64.47 29.18,64.47 X1.1 | X1.34 29.11,48.01 29.11,48.39 X1.33 29.11,48.54 29.11,48.92 X1.32 29.11,49.07 29.11,49.38 X1.31 29.11,49.53 29.11,49.91 X1.30 29.11,50.06 29.11,50.37 X1.29 29.11,50.52 29.11,50.9 X1.28 29.11,51.05 29.11,51.28 | 29.11,51.28 29.11,51.44 X1.27 29.11,51.51 29.11,51.89 X1.26 29.11,52.05 29.11,52.43 X1.25 28.96,52.43 28.35,52.43 27.28,53.49 27.28,55.85 28.42,57 28.96,57 X1.16 29.11,57 29.11,57.38 X1.15 29.11,57.53 29.11,57.91 X1.14 29.11,58.06 29.11,58.37 X1.13 29.11,58.52 29.11,58.9 X1.12 29.18,58.83 v30.33,58.83 | v30.33,62.41 30.02,62.71 30.02,62.87 29.95,62.94 | X1.45 29.11,42.37 26.21,42.37 25.22,41.38 22.48,41.38 21.11,42.75 21.11,44.96 v21.03,45.03 22.55,46.56 T13.2 T12.2 22.48,50.52 20.27,50.52 16.15,54.63 S4.2 | 29.11,51.28 27.66,51.28 v25.91,49.53 | v9.75,52.81 7.77,50.83 7.77,45.8 7.7,45.72 | v50.14,36.8 50.14,34.67 47.02,31.55 v47.02,29.95 | v51.28,10.13 51.28,14.63 50.37,15.54 50.37,19.89 | 50.37,19.89 47.32,22.94 S7.2 | v95.56,50.52 95.56,49.3 98.37,46.48 98.37,45.72 IC4.2 95.94,45.72 95.17,44.96 95.17,43.2 95.33,43.05 v95.33,40.77 97.92,38.18 S5.2 v107.37,36.5 | S2.2 76.73,25.22 69.11,25.22 66.98,23.09 66.98,22.94 S1.2 66.9,23.16 66.37,23.7 57.76,23.7 54.03,19.96 50.44,19.96 50.37,19.89
IO1_0  (via drill 0.38)
  Top 0.152: 56.54,23.55 56.54,27.74 59.21,30.4 59.59,30.4 IC5.31 59.66,30.4 60.73,30.4 66.45,24.69 68.43,24.69 70.18,22.94 S1.4 | v59.13,10.82 56.84,10.82
  Bottom 0.152: v59.13,10.82 71.25,22.94 S1.4
IO1_1
  Top 0.152: 61.3,21.91 57.15,17.75 56.62,17.75 | 61.3,21.91 61.34,21.95 61.34,28.5 60.05,29.79 59.66,29.79 IC5.32 | S2.4 81.23,22.94 74.83,16.54 73.61,16.54 68.96,21.18 62.03,21.18 61.3,21.91
IO1_2  (via drill 0.38)
  Top 0.152: 56.54,21.64 56.54,22.33 57.3,23.09 57.3,24.61 | 57.3,24.61 57.3,28.04 58.37,29.11 59.59,29.11 IC5.33 | v84.43,27.89 79.55,27.89 77.95,26.29 v77.95,25.38 | v58.75,25.22 58.14,24.61 57.3,24.61
  Bottom 0.152: v84.43,27.89 94.11,37.57 94.11,61.42 96.01,63.32 103.4,63.32 110.19,56.54 110.19,54.71 S3.4 | v77.95,25.38 77.19,25.38 72.08,30.48 68.12,30.48 66.83,29.18 66.83,28.88 63.17,25.22 v58.75,25.22
IO1_3  (via drill 0.38)
  Top 0.152: 19.05,55.24 20.12,55.24 S4.4 20.73,54.63 20.73,53.11 22.78,51.05 26.59,51.05 28.19,49.45 v28.19,37.95 | v60.05,21.49 61.04,22.48 61.04,27.51 60.05,28.5 59.66,28.5 IC5.34 | v60.05,9.6 v60.05,12.57 | v57.99,4.04 57.68,4.04 56.84,3.2
  Bottom 0.152: v60.05,12.57 v60.05,21.49 | v60.05,9.6 60.05,6.1 v57.99,4.04 57.99,4.12 57,5.11 46.94,5.11 45.87,6.17 45.87,6.63 46.25,7.01 46.25,10.29 45.64,10.9 42.14,10.9 28.19,24.84 v28.19,37.95
IO4_0  (via drill 0.38)
  Top 0.152: v61.49,32.99 62.64,32.99 65.91,36.27 67.28,36.27 IC5.17 | v56.54,29.11 52.58,29.11 52.05,28.57 IC2.3 | v27.96,55.55 26.59,55.55 24.54,53.49 22.02,53.49 21.64,53.11 21.64,52.65 22.94,51.36 27.96,51.36 28.96,50.37 28.96,40.01 31.17,37.8 v34.21,37.8 | v40.31,31.7 49.99,31.7 v50.44,31.24 | IC1.3 90.3,28.57 86.94,31.93 v86.94,34.98
  Bottom 0.152: v61.49,32.99 57.61,29.11 v56.54,29.11 | v27.96,55.55 27.96,55.93 28.42,56.39 29.11,56.39 X1.17 | v40.31,31.7 v34.21,37.8 | v50.44,31.24 56.54,31.24 59.74,34.44 60.88,34.44 61.42,33.91 61.42,32.99 v61.49,32.99 | v86.94,34.98 86.56,34.98 85.27,36.27 70.41,36.27 65.3,31.17 64.85,31.17 63.78,32.23 63.78,32.61 63.4,32.99 v61.49,32.99
IO4_1  (via drill 0.38)
  Top 0.152: v60.66,33.83 63.02,33.83 66.06,36.88 67.28,36.88 IC5.18 67.36,36.88 67.82,36.88 v68.43,36.27 | v55.63,29.87 52.05,29.87 IC2.4 51.97,29.79 51.51,29.79 v50.14,28.42 | v31.85,42.67 v31.85,46.1 | v88.39,33.98 88.39,31.77 90.3,29.87 90.75,29.87 IC1.4
  Bottom 0.152: v60.66,33.83 59.59,33.83 v55.63,29.87 | v31.85,46.1 31.55,46.41 31.55,49.07 32.77,50.29 32.77,53.34 30.18,55.93 29.18,55.93 X1.18 | v31.85,42.67 31.85,42.37 31.01,41.53 31.01,39.55 41,29.57 44.12,29.57 45.26,28.42 v50.14,28.42 | v88.39,33.98 88.39,34.37 86.18,36.58 68.73,36.58 v68.43,36.27
IO4_2  (via drill 0.38)
  Top 0.152: v60.66,36.35 65.08,36.35 66.29,37.57 67.28,37.57 IC5.19 | v54.86,33.68 52.05,33.68 IC2.7 51.97,33.68 49.45,33.68 46.33,36.8 40.69,36.8 40.01,37.49 36.2,37.49 31.24,42.44 31.24,46.79 32.77,48.31 32.77,49.07 32.16,49.68 v32.16,50.52 | v89.23,33.98 89.53,33.68 90.75,33.68 IC1.7
  Bottom 0.152: v54.86,33.68 56.77,35.59 58.37,35.59 59.13,36.35 v60.66,36.35 61.19,36.88 86.33,36.88 v89.23,33.98 | v32.16,50.52 32.16,53.49 30.25,55.4 29.18,55.4 X1.19
IO4_3  (via drill 0.38)
  Top 0.152: 54.29,36.46 52.81,34.98 52.05,34.98 IC2.8 | 54.29,36.46 56.01,38.18 56.46,38.18 57,37.64 59.59,37.64 IC5.20 59.66,37.57 v60.66,37.57 | v31.55,51.97 33.07,50.44 33.07,42.52 32.77,42.22 32.77,41.6 36.42,37.95 v40.39,37.95 | v45.95,38.56 52.65,38.56 53.72,37.49 53.72,37.03 54.29,36.46 | v89.08,34.98 90.75,34.98 IC1.8
  Bottom 0.152: v31.55,51.97 31.55,53.65 30.33,54.86 29.18,54.86 X1.20 | v40.39,37.95 45.34,37.95 v45.95,38.56 | v89.08,34.98 88.7,34.98 86.11,37.57 v60.66,37.57
IO4_4  (via drill 0.38)
  Top 0.152: IC1.13 80.7,34.98 80.24,34.98 79.4,35.81 79.4,36.58 79.63,36.8 81.76,36.8 81.99,37.03 81.99,37.87 81.84,38.02 66.29,38.02 65.23,36.96 59.66,36.96 IC5.21 59.59,36.96 v57.68,36.96 | v30.94,53.42 33.38,50.98 v33.38,41.99 | v37.95,35.81 40.62,35.81 41.45,34.98 41.91,34.98 IC2.13 41.99,34.98 42.29,35.28 v43.51,35.28
  Bottom 0.152: v30.94,53.42 29.95,54.41 29.18,54.41 X1.21 | v33.38,41.99 33.83,41.53 33.83,39.93 v37.95,35.81 | v57.68,36.96 56.01,36.96 54.71,38.25 46.48,38.25 v43.51,35.28
IO4_5  (via drill 0.38)
  Top 0.152: v58.29,36.35 59.59,36.35 IC5.22 | v36.96,38.56 36.27,38.56 33.98,40.84 33.98,51.21 31.17,54.03 28.04,54.03 v27.96,53.95
  Bottom 0.152: v58.29,36.35 56.16,36.35 54.56,37.95 47.02,37.95 43.74,34.67 40.84,34.67 v36.96,38.56 | v27.96,53.95 29.11,53.95 X1.22
IO4_6  (via drill 0.38)
  Top 0.152: v56.24,37.57 58.14,35.66 59.59,35.66 IC5.23
  Bottom 0.152: v56.24,37.57 55.85,37.57 53.95,39.47 36.27,39.47 35.36,40.39 35.36,41.76 30.48,46.63 30.48,52.73 29.79,53.42 29.18,53.42 X1.23
IO4_7  (via drill 0.38)
  Top 0.152: v58.37,34.98 59.59,34.98 IC5.24 | v49.15,32.69 43.36,32.69 42.98,33.07 v36.65,33.07
  Bottom 0.152: v58.37,34.98 57,34.98 54.71,32.69 v49.15,32.69 | v36.65,33.07 36.65,33.45 30.18,39.93 30.18,52.58 29.87,52.88 29.18,52.88 X1.24
LD_/C  (via drill 0.38)
  Top 0.152: v28.12,65.38 30.48,63.02 30.56,63.02 30.94,62.64 30.94,61.04 v30.48,60.58 | v54.56,34.82 57.61,31.77 59.59,31.77 IC5.29 | v34.75,54.33 v34.75,41.53
  Bottom 0.152: v30.48,60.58 29.95,60.58 29.87,60.5 29.18,60.5 X1.9 | R47.1 18.44,65.38 v28.12,65.38 30.02,65.38 34.75,60.66 v34.75,54.33 | v54.56,34.82 52.96,34.82 50.37,37.41 46.94,37.41 43.89,34.37 40.69,34.37 37.11,37.95 36.73,37.95 34.75,39.93 v34.75,41.53
LEDK1
  Bottom 0.152: R37.2 22.86,53.95 22.86,51.28 23.85,50.29 23.85,49.84 24.84,48.84 25.07,48.84 27.43,46.48 29.11,46.48 X1.37
LEDK2  (via drill 0.38)
  Top 0.152: v24.84,48.23 23.09,49.99 15.32,49.99 12.19,46.86 12.19,45.87 12.65,45.41 12.65,44.5 R38.2
  Bottom 0.152: v24.84,48.23 25.22,48.23 27.51,45.95 29.11,45.95 X1.38
LEDK3
  Bottom 0.152: R39.2 24.31,44.73 27.51,44.73 28.19,45.41 29.11,45.41 X1.39
LEDK4
  Bottom 0.152: R40.2 24.31,42.22 25.45,42.22 28.12,44.88 29.11,44.88 X1.40
LHVTRIG  (via drill 0.38)
  Top 0.152: v100.28,17.37 109.04,26.14 113.31,26.14 115.67,28.5 115.67,30.02 114,31.7 112.39,31.7 R13.1 | v87.48,16.46 85.72,16.46 83.97,18.21 v81.99,18.21 | v69.42,24.54 69.04,24.54 68.12,25.45 66.14,25.45 60.5,31.09 59.66,31.09 IC5.30
  Bottom 0.152: v100.28,17.37 100.28,17.14 99.44,16.31 87.63,16.31 v87.48,16.46 | v81.99,18.21 79.93,18.21 73.46,24.69 69.57,24.69 v69.42,24.54
LLED  (via drill 0.38)
  Top 0.152: 16.69,41.91 16.69,44.27 16.84,44.42 R44.1 | v60.66,32.99 59.66,32.99 IC5.27 | v37.87,34.98 36.04,34.98 34.14,36.88 25.98,36.88 R41.1 22.78,40.01 20.88,41.91 R43.1 20.42,41.91 19.74,41.22 18.67,41.22 17.98,41.91 16.69,41.91 | 16.69,41.91 R42.1
  Bottom 0.152: v60.66,32.99 59.59,32.99 55.63,29.03 45.11,29.03 39.17,34.98 v37.87,34.98
LRD  (via drill 0.38)
  Top 0.152: v27.96,62.48 27.96,60.96 29.11,59.82 29.11,59.21 v30.33,57.99 32.77,55.55 v33.68,55.55 | v65.08,31.77 67.28,31.77 IC5.10 | v32.46,47.17 v32.46,43.81
  Bottom 0.152: v27.96,62.48 27.43,62.48 26.29,63.63 22.17,63.63 18.44,59.89 18.44,59.74 R50.1 | v30.33,57.99 30.94,58.6 30.94,59.05 30.56,59.44 29.18,59.44 X1.11 | v65.08,31.77 62.1,34.75 58.98,34.75 56.08,31.85 49.76,31.85 47.24,29.34 45.26,29.34 36.96,37.64 36.58,37.64 34.14,40.08 34.14,42.14 v32.46,43.81 | v32.46,47.17 32.46,48.31 33.68,49.53 v33.68,55.55
LRESET  (via drill 0.38)
  Top 0.152: v56.01,35.66 57.91,33.76 59.59,33.76 IC5.26 | v54.33,37.34 52.2,39.47 36.27,39.47 35.66,40.08 35.66,54.71 30.4,59.97 30.25,59.97 29.87,60.35 29.87,60.96 v30.33,61.42
  Bottom 0.152: v54.33,37.34 v56.01,35.66 | v30.33,61.42 29.18,61.42 X1.7
LTS+  (2 unrouted)
  Top 0.152: 92.81,26.14 92.81,17.98 88.92,14.1 88.92,2.13 X3.1
LTS-  (2 unrouted)
  Top 0.152: 100.43,26.14 100.43,23.09 98.45,21.11 98.45,16.84 93.5,11.89 93.5,5.41 X3.2
LVSEL
  Top 0.152: IC5.14 67.36,34.37 72.31,34.37 75.36,37.41 80.7,37.41 IC1.11
LWR  (via drill 0.38)
  Top 0.152: v65.61,30.25 66.45,31.09 67.28,31.09 IC5.9 | v39.47,26.98 39.47,29.41 v32.92,35.97 | v29.57,40.23 29.57,46.25 v32.16,48.84
  Bottom 0.152: 30.75,60.01 30.71,59.97 29.18,59.97 X1.10 | 30.75,60.01 31.09,60.35 31.09,63.86 30.02,64.92 28.5,64.92 28.35,64.77 22.86,64.77 19.74,61.65 18.44,61.65 R49.1 | v65.61,30.25 66.22,29.64 66.22,29.18 63.17,26.14 57.99,26.14 56.62,24.77 54.94,24.77 53.87,25.83 42.6,25.83 41.45,26.98 v39.47,26.98 | v32.92,35.97 32.92,36.73 29.57,40.08 v29.57,40.23 | v32.16,48.84 32.16,49.23 33.07,50.14 33.07,57.68 30.75,60.01
N$1
  Top 0.152: R1.1 95.86,47.62 92.66,44.42 92.66,40.16 91.97,39.47 89.84,39.47 85.88,35.51 85.88,31.09 89.61,27.36 90.75,27.36 IC1.2
N$2
  Top 0.152: R2.1 102.18,35.51 102.03,35.51 97.69,31.17 90.75,31.17 IC1.5
N$3
  Top 0.152: IC1.6 91.21,32.38 94.34,35.51 95.86,35.51 R3.1
N$4
  Top 0.152: R4.1 93.12,38.1 91.21,36.2 IC1.9
N$5
  Top 0.152: IC1.12 81.15,36.2 81.99,35.36 81.99,34.37 89.61,26.75 91.9,26.75 92.05,26.9 92.05,28.27 93.5,29.72 96.7,29.72 101.04,34.06 103.78,34.06 110.34,40.62 112.32,40.62 R5.1
N$6
  Top 0.152: T8.1 95.86,59.74 96.55,60.43 96.55,65.61 96.7,65.76 101.96,65.76 107.9,59.82 L3.2 107.97,59.82 109.12,60.96 SG1.-
N$7
  Top 0.152: T4.3 108.89,45.41 108.13,45.41 106.38,43.66 101.12,43.66 97.23,39.78 97.23,38.1 R4.2
N$8
  Top 0.152: T5.3 114,39.17 114,40.31 113.69,40.62 R5.2
N$9
  Top 0.152: D2.A 124.44,27.36 124.44,29.18 121.92,31.7 H1.4 121.84,31.7 115.98,25.83 109.19,25.83 105.46,22.1 105.46,19.05 F1.P$1
N$10
  Top 0.152: R7.1 95.56,53.34 T1.1
N$11
  Top 0.152: T2.1 101.58,42.98 106.3,42.98 108.05,44.73 110.34,44.73 113.61,48.01 119.1,48.01 121.23,50.14 R8.1
N$12
  Top 0.152: T3.1 121.92,53.57 121.92,52.73 121.31,52.12 R9.1
N$13
  Top 0.152: T1.3 97.54,49.84 97.23,49.53 R1.2
N$14
  Top 0.152: T2.3 100.66,40.84 100.66,40.69 101.58,39.78 101.58,36.2 100.97,35.59 R2.2
N$15
  Top 0.152: T3.3 122.91,58.75 115.14,66.52 95.56,66.52 92.89,63.86 92.89,54.03 96.55,50.37 96.55,48.23 97.54,47.24 97.54,42.67 97.77,42.44 97.77,40.77 96.55,39.55 96.55,36.2 97.16,35.59 R3.2
N$16  (via drill 0.38)
  Top 0.152: T4.1 108.66,43.43 v109.35,44.12 | v115.59,44.12 119.1,47.62 R10.1
  Bottom 0.152: v115.59,44.12 v109.35,44.12
N$17  (via drill 0.38)
  Top 0.152: IC7.7 121.31,41.99 121.31,42.52 122.53,43.74 122.53,45.03 R11.2 122.53,45.11 v122.53,46.18 | R7.2 102.26,51.05 102.49,50.83 C1.2 102.56,50.83 v107.29,50.83 | R10.2 122.61,47.62 122.61,50.14 R8.2 122.61,50.22 122.61,51.05 | 122.61,51.05 122.61,52.05 R9.2 | 122.61,51.05 v121.92,51.05
  Bottom 0.152: v107.29,50.83 121.69,50.83 v121.92,51.05 121.77,50.83 122.53,50.06 v122.53,46.18
N$18  (via drill 0.38)
  Top 0.152: 100.66,48.01 100.66,50.75 C1.1 | 100.66,48.01 100.66,47.02 C5.1 | 125.01,26.78 125.27,27.05 125.27,37.11 124.28,38.1 120.85,38.1 120.74,37.99 | 125.01,26.78 124.97,26.75 123.9,26.75 123.37,27.28 122,27.28 D2.C | 120.74,37.99 120.02,37.26 120.02,36.8 | 120.74,37.99 120.7,38.02 120.7,43.13 121.23,43.66 121.23,45.03 R11.1 121.16,45.03 v120.4,45.8 | 120.02,36.8 117.81,36.8 C6.1 | 120.02,36.8 IC7.1 | 125.01,26.78 125.42,26.36 125.42,5.64 123.67,3.89 106.15,3.89 105.46,4.57 105.46,8.84 F1.P$2 | 100.66,48.01 103.63,48.01 v104.39,47.24
  Bottom 0.152: v104.39,47.24 105.84,45.8 v120.4,45.8
N$19
  Top 0.152: H2.4 5.71,31.7 3.2,29.18 3.2,27.36 D1.A 3.12,27.28 2.59,26.75 2.59,19.05 F2.P$1
N$20  (via drill 0.38)
  Top 0.152: v9.68,44.73 8.46,45.95 R15.1 | v20.73,36.58 23.39,36.58 29.64,30.33 33.53,30.33 37.49,26.36 39.7,26.36 40.69,27.36 40.69,27.74 40.84,27.89 v44.5,27.89 | v50.14,27.36 51.97,27.36 IC2.2
  Bottom 0.152: v9.68,44.73 12.57,44.73 v20.73,36.58 | v44.5,27.89 44.88,27.89 46.02,26.75 49.53,26.75 v50.14,27.36
N$21
  Top 0.152: R13.2 112.39,33.07 113.61,33.07 114.53,33.98 H1.1
N$22
  Top 0.152: T8.3 94.94,57.45 94.94,60.05 95.86,60.96 R14.2
N$24  (via drill 0.38)
  Top 0.152: v12.72,49.15 12.72,50.75 R16.1 | v18.06,40.62 21.11,40.62 25.15,36.58 33.98,36.58 36.35,34.21 48.46,34.21 51.51,31.17 51.97,31.17 IC2.5
  Bottom 0.152: v12.72,49.15 12.72,45.95 v18.06,40.62
N$25  (via drill 0.38)
  Top 0.152: v32.77,26.67 18.75,26.67 8.23,37.19 8.23,42.9 6.48,44.65 6.48,46.48 7.47,47.47 7.47,48.46 8.23,49.23 8.23,50.29 R17.1 | v43.74,28.65 44.88,28.65 46.79,30.56 53.19,30.56 53.26,30.63 53.26,31.55 52.43,32.38 IC2.6
  Bottom 0.152: v32.77,26.67 35.36,26.67 37.49,28.8 43.59,28.8 v43.74,28.65
N$26  (via drill 0.38)
  Top 0.152: v22.25,52.88 26.06,52.88 28.12,54.94 34.98,54.94 35.36,54.56 35.36,39.93 36.12,39.17 44.5,39.17 45.95,37.72 48.39,37.72 49.91,36.2 IC2.9
  Bottom 0.152: v22.25,52.88 20.27,52.88 18.36,54.79 18.36,57.99 R18.1
N$27  (via drill 0.38)
  Top 0.152: v17.45,55.24 17.45,60.05 12.72,64.77 12.72,65.53 R19.1 | v21.49,51.21 22.17,51.21 22.63,50.75 26.44,50.75 27.89,49.3 27.89,38.48 27.58,38.18 27.58,37.72 28.12,37.19 39.85,37.19 40.84,36.2 IC2.12
  Bottom 0.152: v21.49,51.21 v17.45,55.24
N$28  (via drill 0.38)
  Top 0.152: v24.16,47.55 22.25,47.55 21.11,46.41 17.53,46.41 15.62,44.5 R44.2
  Bottom 0.152: v24.16,47.55 24.46,47.24 24.46,46.63 T13.3
N$29
  Top 0.152: T6.3 10.9,46.41 9.14,46.41 8.84,46.71 7.85,46.71 7.16,46.02 R15.2
N$30
  Top 0.152: T7.3 13.18,54.33 13.03,54.33 11.43,52.73 11.43,50.83 R16.2
N$31
  Top 0.152: T9.3 8.38,56.01 7.62,55.24 7.62,51.82 7.01,51.21 7.01,50.29 R17.2
N$32  (via drill 0.38)
  Top 0.152: v14.33,58.14 13.11,58.14 T10.3
  Bottom 0.152: v14.33,58.14 16.92,58.14 16.99,58.06 R18.2
N$33
  Top 0.152: T11.3 13.03,63.25 13.03,63.93 11.43,65.53 R19.2
N$35
  Top 0.152: T6.1 11.89,48.39 11.89,46.1 9.83,44.04 9.83,39.7 10.13,39.4 R22.1
N$36
  Top 0.152: R23.1 9.75,48.01 12.04,50.29 12.04,51.28 12.19,51.44 12.19,52.27 T7.1
N$37
  Top 0.152: T9.1 6.33,57.38 6.33,52.96 6.93,52.35 R24.1
N$38
  Top 0.152: T10.1 12.04,56.08 9.6,56.08 8.31,54.79 R25.1
N$39  (via drill 0.38)
  Top 0.152: v7.01,53.72 7.01,54.71 R25.2 | v8.23,53.34 8.23,52.35 R24.2 8.23,52.27 8.23,51.97 7.62,51.36 7.62,49.76 6.86,49 6.86,48.01 R23.2 6.78,48.01 6.78,47.24 6.17,46.63 6.17,44.12 v6.25,44.04 | R22.2 8.91,39.32 8.91,37.41 10.52,35.81 12.65,35.81 13.64,36.8 C2.2 13.72,36.88 14.4,37.57 v14.86,37.57 | v14.86,38.94 14.48,39.32 14.02,39.32 R26.2 | v5.64,40.31 4.5,41.45 4.5,41.91 IC8.7
  Bottom 0.152: v7.01,53.72 7.85,53.72 v8.23,53.34 | v14.86,37.57 v14.86,38.94 13.18,40.62 11.58,40.62 11.28,40.31 6.25,40.31 | 6.25,40.31 v5.64,40.31 | 6.25,40.31 v6.25,44.04
N$40  (via drill 0.38)
  Top 0.152: 3.5,18.14 3.5,9.83 2.59,8.91 F2.P$2 | 3.5,18.14 3.5,21.72 5.64,23.85 5.64,27.28 D1.C | 3.12,35.28 3.12,36.73 IC8.1 | 3.12,35.28 1.6,33.76 1.6,18.29 1.75,18.14 3.5,18.14 | v11.81,40.01 12.42,39.4 12.65,39.4 R26.1 | v11.66,38.1 11.66,36.96 11.73,36.88 C2.1 11.66,36.88 11.35,36.58 v10.59,36.58 | v14.4,34.06 16.61,34.06 21.11,29.57 32.99,29.57 35.2,27.36 35.2,22.86 C8.1 35.28,22.86 37.72,20.42 37.72,18.9 39.01,17.6 40.69,17.6 41.91,16.38 41.91,15.39 44.12,13.18 v51.97,13.18 | v55.63,13.18 60.27,13.18 62.64,10.82 67.59,10.82 C7.1 | v3.81,35.28 3.12,35.28
  Bottom 0.152: v11.81,40.01 11.81,38.25 v11.66,38.1 | v14.4,34.06 13.11,34.06 v10.59,36.58 10.59,36.5 9.37,35.28 v3.81,35.28 | v51.97,13.18 v55.63,13.18
N$41
  Bottom 0.152: T12.1 23.55,52.5 23.55,53.42 24.08,53.95 R37.1
N$42  (via drill 0.38)
  Top 0.152: R21.2 74.3,13.26 v71.02,9.98 | v25.38,21.34 22.25,21.34 14.17,29.41 13.11,29.41 H2.1
  Bottom 0.152: v71.02,9.98 62.64,1.6 44.2,1.6 32.08,13.72 31.24,13.72 29.87,15.09 29.87,16.84 v25.38,21.34
N$43
  Top 0.152: T15.1 11.89,43.05 11.89,43.97 11.43,44.42 R38.1
N$44  (via drill 0.38)
  Top 0.152: T14.1 20.04,43.43 20.5,42.98 21.49,42.98 v22.33,43.81
  Bottom 0.152: v22.33,43.81 22.33,44.04 22.94,44.65 R39.1
N$45
  Top 0.152: IC7.4 123.83,36.27 122.99,35.43 115.52,35.43 113.92,37.03 113.08,37.03 T5.1
N$46
  Bottom 0.152: T13.1 23.55,48.62 23.55,45.26 23.62,45.19 23.62,42.82 23.01,42.22 R40.1
N$47
  Top 0.152: T11.1 12.04,61.19 10.9,61.19 8.69,58.98 6.78,58.98 5.64,57.84 5.64,43.81 6.4,43.05 6.4,38.33 6.93,37.8 6.93,36.8 IC8.4
N$48
  Top 0.152: T14.3 19.13,43.66 19.13,41.91 R43.2
N$49  (via drill 0.38)
  Top 0.152: v26.59,48.16 26.59,42.44 24.16,40.01 R41.2
  Bottom 0.152: v26.59,48.16 26.44,48.16 24.54,50.06 24.54,50.37 T12.3
N$50
  Top 0.152: T15.3 10.97,41 11.73,41 12.42,40.31 13.72,40.31 15.32,41.91 R42.2
RHVTRIG
  Top 0.152: R21.1 74.3,23.16 70.33,27.13 67.36,27.13 IC5.3
RTS+  (via drill 0.38)  (2 unrouted)
  Top 0.152: v29.26,21.87 v29.26,16.61
  Bottom 0.152: X5.1 38.1,3.05 29.26,11.89 v29.26,16.61 | v29.26,21.87 29.26,22.55 24.77,27.05
RTS-  (2 unrouted)
  Top 0.152: 32.38,27.89 34.14,26.14 34.14,13.49 42.22,5.41 42.6,5.41 X5.2
RVSEL
  Top 0.152: IC5.25 59.59,34.37 58.14,34.37 56.24,36.27 55.09,36.27 53.19,34.37 49.23,34.37 46.18,37.41 41.99,37.41 IC2.11
SCL  (via drill 0.38)
  Top 0.152: v71.55,33.68 67.36,33.68 IC5.13 | v80.01,19.66 76.28,15.93 v76.28,12.19 | v76.28,7.24 76.28,7.62 76.66,8 76.66,9.3 X2.2 | v72.54,4.27 70.41,2.13 54.18,2.13 54.03,2.29 54.03,4.04 52.96,5.11 50.52,5.11 48.16,7.47 48.16,9.3 X4.2
  Bottom 0.152: v71.55,33.68 71.55,32.61 80.01,24.16 v80.01,19.66 | v76.28,12.19 v76.28,7.24 75.51,7.24 v72.54,4.27
SDA  (via drill 0.38)
  Top 0.152: v72.39,33.6 71.86,33.07 67.36,33.07 IC5.12 | v81.99,17.07 81.99,14.78 v79.7,12.5 | v78.18,11.43 77.5,10.74 77.5,9.37 X2.3 77.42,9.3 77.42,7.54 75.59,5.71 71.86,5.71 71.32,5.18 54.25,5.18 54.03,5.41 50.67,5.41 48.92,7.16 48.92,9.3 X4.3
  Bottom 0.152: v72.39,33.6 72.39,32.23 82.53,22.1 82.53,18.52 82.6,18.44 82.6,17.68 v81.99,17.07 | v79.7,12.5 79.25,12.5 v78.18,11.43
SPKR  (via drill 0.38)
  Top 0.152: v93.5,59.89 94.56,60.96 R14.1 | v68.35,32.46 67.36,32.46 IC5.11
  Bottom 0.152: v93.5,59.89 93.5,37.41 89.46,33.38 75.51,33.38 73.23,35.66 71.55,35.66 v68.35,32.46
TCK  (via drill 0.38)  (1 unrouted)
  Top 0.152: 56.54,19.74 56.92,19.74 60.73,23.55 60.73,27.13 60.05,27.81 59.66,27.81 IC5.35 | 67.67,6.93 67.82,6.93 68.81,5.94 70.26,5.94 70.41,6.1 70.41,11.66 70.37,11.7 | 70.37,11.7 69.88,12.19 61.72,12.19 59.66,14.25 56.08,14.25 55.93,14.4 55.93,17.07 | 55.93,17.07 55.93,19.13 56.46,19.66 | 70.37,11.7 v70.56,11.89 | v14.94,56.08 14.94,59.59 12.57,61.95 11.2,61.95 9.53,60.27 7.62,60.27 5.79,58.45 3.81,58.45 SV1.3 | v45.03,21.26 45.41,21.26 48.46,18.21 53.65,18.21 54.79,17.07 55.93,17.07
  Bottom 0.152: S5.4 109.96,38.18 97.46,25.68 97.46,22.25 104.01,15.7 104.01,14.78 103.17,13.95 85.04,13.95 84.2,13.11 71.78,13.11 v70.56,11.89 | v14.94,56.08 14.94,53.57 19.66,48.84 19.66,43.59 24.69,38.56 29.11,38.56 30.63,37.03 30.63,27.51 36.88,21.26 v45.03,21.26
TDI  (via drill 0.38)
  Top 0.152: 6.02,60.96 4.5,59.44 2.59,59.44 2.06,58.9 2.06,55.09 SV1.5 3.73,53.34 3.73,52.96 2.06,51.28 2.06,44.88 3.89,43.05 3.89,40.39 6.4,37.87 6.4,35.59 7.24,34.75 10.21,34.75 19.05,25.91 v33.53,25.91 | v57.91,25.22 59.21,26.52 59.59,26.52 IC5.37 | 113.31,27.89 113.16,27.89 111.71,26.44 108.51,26.44 99.29,17.22 v99.06,17.22
  Bottom 0.152: v99.06,17.22 91.44,17.22 82.22,26.44 80.39,26.44 72.54,34.29 71.32,34.29 66.52,29.49 66.52,29.03 63.32,25.83 58.52,25.83 v57.91,25.22 57.53,25.22 56.77,24.46 54.79,24.46 54.56,24.69 53.57,24.69 51.82,22.94 S7.4 51.74,22.94 49.99,24.69 43.28,24.69 42.06,25.91 v33.53,25.91
TDO  (via drill 0.38)  (1 unrouted)
  Top 0.152: v92.2,21.57 89.53,21.57 | v99.06,19.05 100.66,19.05 106.3,24.69 106.3,27.89 | v57.38,22.33 59.59,24.54 59.59,25.83 IC5.38 | v48.54,18.97 v54.03,18.97 | v34.75,13.72 34.75,16.99 36.8,19.05
  Bottom 0.152: v92.2,21.57 96.55,21.57 v99.06,19.05 99.06,18.06 99.67,17.45 99.67,16.99 99.29,16.61 88.16,16.61 87.71,17.07 87.25,17.07 83.9,13.72 62.87,13.72 59.36,10.21 58.9,10.21 57.99,11.12 57.99,21.34 57.23,22.1 v57.38,22.33 v54.03,18.97 | v48.54,18.97 43.66,18.97 42.29,17.6 38.33,17.6 36.88,19.05 | SV1.6 3.81,50.44 1.75,48.39 1.75,42.9 7.47,37.19 13.49,37.19 23.01,27.66 23.01,26.82 30.63,19.2 30.63,14.78 31.39,14.02 34.44,14.02 v34.75,13.72
TEST  (via drill 0.38)
  Top 0.152: 89.53,15.85 v85.19,15.85 80.09,10.74 80.09,7.47 74.22,1.6 44.81,1.6 43.43,2.97 38.18,2.97 31.09,10.06 27.43,10.06 v24.61,7.24 | v72.77,23.85 70.79,25.83 67.36,25.83 IC5.1
  Bottom 0.152: v85.19,15.85 83.97,14.63 83.06,14.63 73.84,23.85 v72.77,23.85 | SV1.1 3.81,63.17 1.45,60.81 1.45,7.01 4.57,3.89 21.26,3.89 v24.61,7.24
TMS  (via drill 0.38)
  Top 0.152: v6.71,61.95 6.71,63.48 | v58.6,28.5 58.6,27.89 59.28,27.2 59.59,27.2 IC5.36 59.66,27.13 60.12,27.13 60.43,26.82 60.43,24.92 59.36,23.85 v59.36,23.01 | v37.72,28.19 36.12,28.19 32.31,32 28.42,32 21.64,38.79 20.73,38.79 S6.4 | 67.59,3.2 65.08,3.2 v64.24,4.04 | v64.24,18.14 v64.24,12.8
  Bottom 0.152: v6.71,61.95 6.71,58.83 5.68,57.8 | 5.68,57.8 3.81,55.93 SV1.4 | v58.6,28.5 52.12,28.5 50.06,26.44 42.9,26.44 41.15,28.19 v37.72,28.19 | v64.24,12.8 v64.24,4.04 | v59.36,23.01 v64.24,18.14 | 5.68,57.8 15.16,48.31 15.16,44.35 20.65,38.86 S6.4
VBAT  (via drill 0.38)
  Top 0.152: v95.86,43.51 R45.1 | v103.1,44.81 102.56,44.81 102.26,44.5 R46.2 | v63.17,32.38 59.66,32.38 IC5.28 | v87.55,34.37 87.55,35.97 90.3,38.71 92.43,38.71 95.63,41.91 R45.1 | R45.1
  Bottom 0.152: v95.86,43.51 95.86,43.81 95.63,44.04 95.63,44.81 96.16,45.34 97.54,45.34 98.07,44.81 v103.1,44.81 | v63.17,32.38 64.69,30.86 65.91,30.86 71.02,35.97 85.11,35.97 86.72,34.37 v87.55,34.37
VCC  (via drill 0.38)  (1 unrouted)
  Top 0.305: IC3.3 117.27,44.12 117.73,44.12 120.47,46.86 123.06,46.86 123.29,47.09 123.29,53.95 121.69,55.55 121.69,58.14 118.87,60.96 SG1.+ 118.72,61.04 117.35,62.41 111.78,62.41 111.63,62.26 108.05,62.26 L3.1 107.9,62.18 103.94,66.14 96.47,66.14 95.63,65.3 95.63,64.77 C10.1 95.48,64.69 v95.48,61.95 | v45.41,10.29 46.33,9.37 47.24,9.37 X4.1 47.24,9.53 47.24,10.74 47.78,11.28 51.66,11.28 53.65,9.3 53.65,6.4 54.48,5.56 70.48,5.56 71.02,6.1 74.07,6.1 75.82,7.85 75.82,9.3 X2.1 75.97,9.45 75.97,10.9 80.09,15.01 80.09,17.98 82.91,20.8 83.74,20.8 87.25,24.31 v87.25,24.61
  Bottom 0.305: 96.47,31.17 96.47,24.61 | 96.47,24.61 96.47,22.63 102.18,16.92 102.18,15.24 102.23,15.24 | 24.77,32.99 26.59,31.17 26.59,25.83 32.38,20.04 32.38,15.24 32.46,15.16 34.29,15.16 39.17,10.29 v45.41,10.29 | v87.25,24.61 96.47,24.61 | v95.48,61.95 95.48,55.09 94.64,54.25 94.64,33.15
XIN
  Top 0.152: IC5.6 67.36,29.18 72.77,29.18 73.61,30.02 Q3.2 73.69,30.1 73.91,30.33 73.91,31.7 C12.1
XOUT
  Top 0.152: IC5.5 67.36,28.5 73.53,28.5 73.61,28.42 Q3.1 73.69,28.35 74.98,27.05 76.2,27.05 C11.1